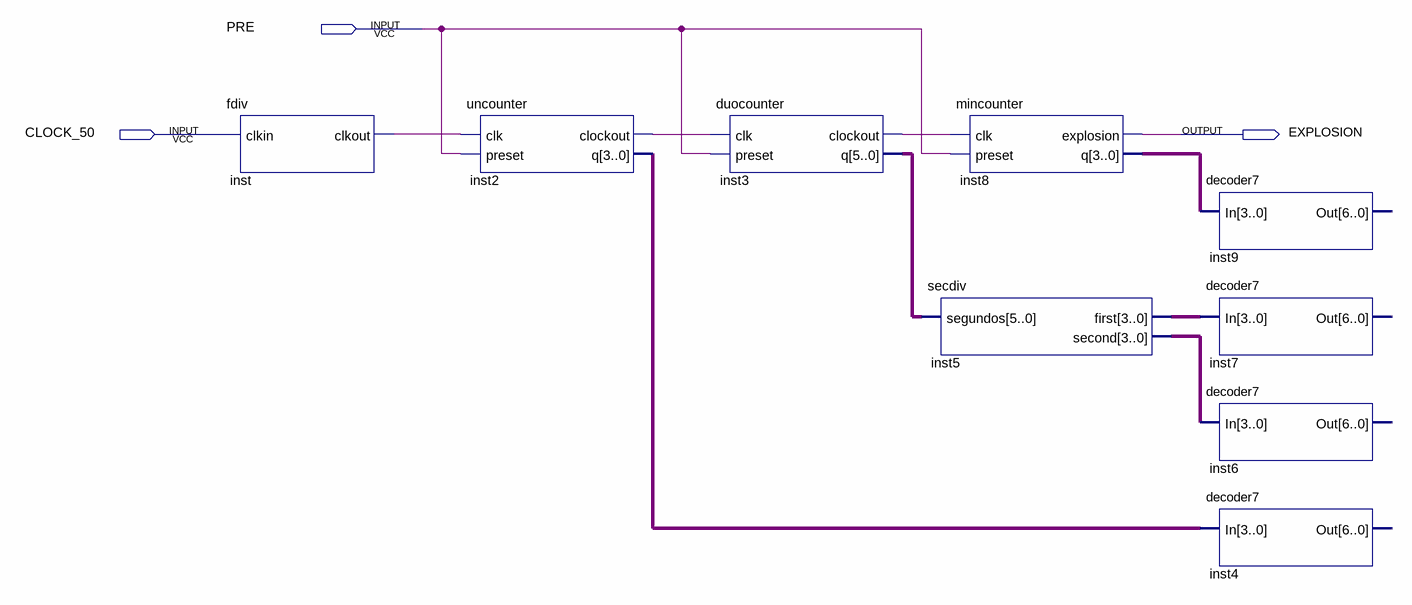
[diagram p0: schematic sheet]
// Quartus schematic PF.bdf as structural Verilog: 9 symbols, 3 pins
module PF (
  input  PRE,
  input  CLOCK_50,
  output EXPLOSION
);

  wire inst2_clockout, inst3_clockout, inst_clkout;
  wire [3:0] inst2_q, inst5_first, inst5_second, inst8_q;
  wire [5:0] inst3_q;

  fdiv inst (.clkin(CLOCK_50), .clkout(inst_clkout));
  uncounter inst2 (.clk(inst_clkout), .preset(PRE), .clockout(inst2_clockout), .q(inst2_q));
  duocounter inst3 (.clk(inst2_clockout), .preset(PRE), .clockout(inst3_clockout), .q(inst3_q));
  mincounter inst8 (.clk(inst3_clockout), .preset(PRE), .explosion(EXPLOSION), .q(inst8_q));
  secdiv inst5 (.segundos(inst3_q), .first(inst5_first), .second(inst5_second));
  decoder7 inst9 (.In(inst8_q));  // open: Out
  decoder7 inst7 (.In(inst5_first));  // open: Out
  decoder7 inst6 (.In(inst5_second));  // open: Out
  decoder7 inst4 (.In(inst2_q));  // open: Out
endmodule
